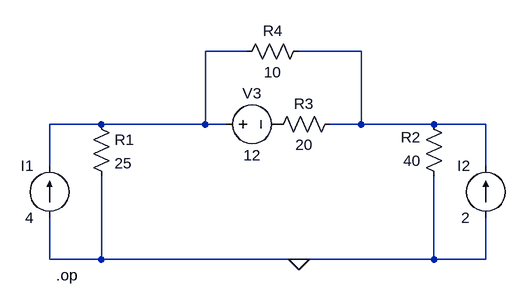
[diagram p0: schematic Draft1.asc]
Draft1.asc, the LTspice schematic file:
Version 4
SHEET 1 880 680
WIRE 240 -48 176 -48
WIRE 416 -48 320 -48
WIRE 16 64 -64 64
WIRE 176 64 176 -48
WIRE 176 64 16 64
WIRE 208 64 176 64
WIRE 416 64 416 -48
WIRE 416 64 368 64
WIRE 528 64 416 64
WIRE 608 64 528 64
WIRE -64 128 -64 64
WIRE 608 128 608 64
WIRE -64 272 -64 208
WIRE 16 272 16 144
WIRE 16 272 -64 272
WIRE 320 272 16 272
WIRE 528 272 528 144
WIRE 528 272 320 272
WIRE 608 272 608 208
WIRE 608 272 528 272
FLAG 320 272 0
SYMBOL voltage 192 64 M90
WINDOW 0 -32 56 VBottom 2
WINDOW 3 32 56 VTop 2
WINDOW 123 0 0 Left 0
WINDOW 39 0 0 Left 0
SYMATTR InstName V3
SYMATTR Value 12
SYMBOL res 0 48 R0
SYMATTR InstName R1
SYMATTR Value 25
SYMBOL res 384 48 R90
WINDOW 0 0 56 VBottom 2
WINDOW 3 32 56 VTop 2
SYMATTR InstName R3
SYMATTR Value 20
SYMBOL res 336 -64 R90
WINDOW 0 0 56 VBottom 2
WINDOW 3 32 56 VTop 2
SYMATTR InstName R4
SYMATTR Value 10
SYMBOL res 544 160 R180
WINDOW 0 36 76 Left 2
WINDOW 3 36 40 Left 2
SYMATTR InstName R2
SYMATTR Value 40
SYMBOL current -64 208 R180
WINDOW 0 24 80 Left 2
WINDOW 3 24 0 Left 2
WINDOW 123 0 0 Left 0
WINDOW 39 0 0 Left 0
SYMATTR InstName I1
SYMATTR Value 4
SYMBOL current 608 208 R180
WINDOW 0 24 80 Left 2
WINDOW 3 24 0 Left 2
WINDOW 123 0 0 Left 0
WINDOW 39 0 0 Left 0
SYMATTR InstName I2
SYMATTR Value 2
TEXT -54 296 Left 2 !.op

The netlist it stands for:
* Draft1.asc
V3 N001 P001 12
R1 N001 0 25
R3 N002 P001 20
R4 N002 N001 10
R2 0 N002 40
I1 0 N001 4
I2 0 N002 2
.op
.backanno
.end